# EAGLE schematic MPU-6050_BreakoutV11 (EAGLE 6.1)
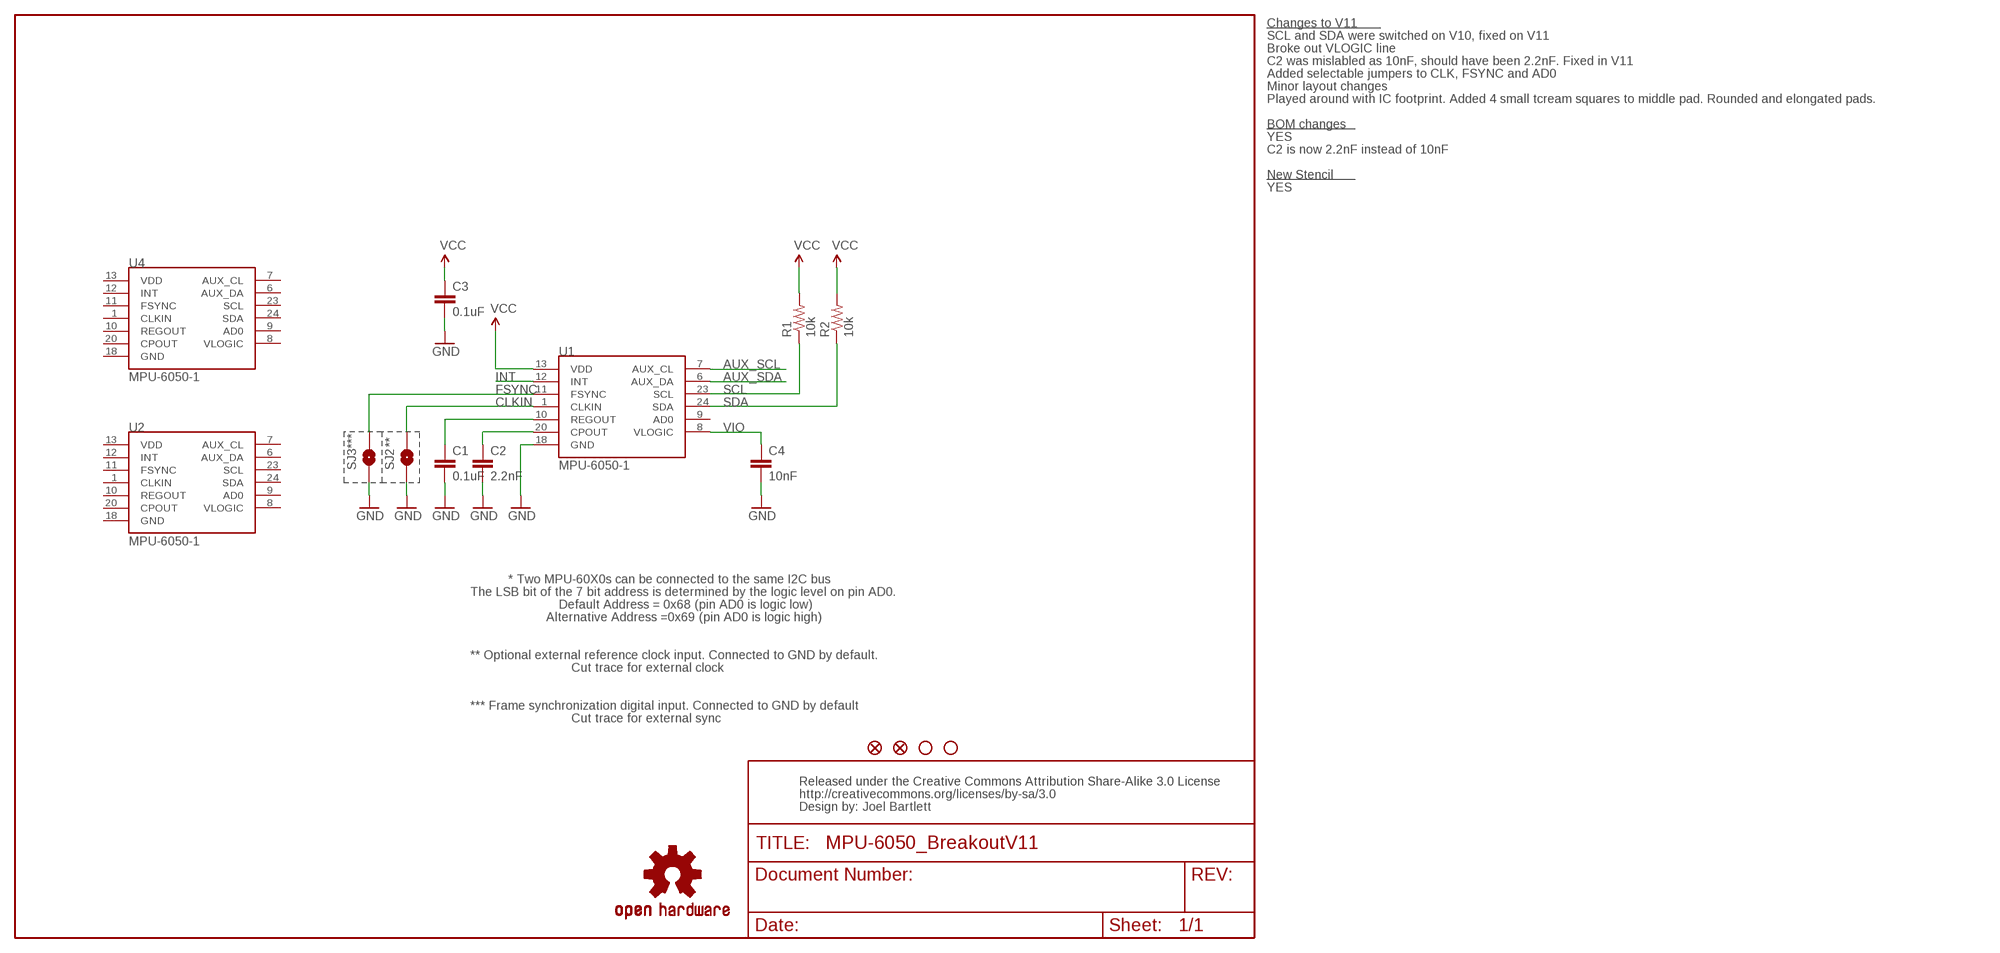
[diagram p0: schematic, sheet 1]

## Parts
C1  0.1uF  CAP0402-CAP  [0402-CAP]
C2  2.2nF  CAP0402-CAP  [0402-CAP]
C3  0.1uF  CAP0402-CAP  [0402-CAP]
C4  10nF  CAP0402-CAP  [0402-CAP]
JP2  FIDUCIALUFIDUCIAL  [MICRO-FIDUCIAL]
JP3  STAND-OFFTIGHT  [STAND-OFF-TIGHT]
JP4  STAND-OFFTIGHT  [STAND-OFF-TIGHT]
JP5  FIDUCIALUFIDUCIAL  [MICRO-FIDUCIAL]
R1  10k  RESISTOR0402-RES  [0402-RES]
R2  10k  RESISTOR0402-RES  [0402-RES]
SJ2  SOLDERJUMPERTRACE  [SJ_2S-TRACE]
SJ3  SOLDERJUMPERTRACE  [SJ_2S-TRACE]
U1  MPU-6050-1  [QFN-24-4MM2]
U2  MPU-6050-1  [QFN-24-4MM2]
U3  CREATIVE_COMMONS  [CREATIVE_COMMONS]
U4  MPU-6050-1  [QFN-24-4MM2]
U$1  OSHW-LOGOS  [OSHW-LOGO-S]

## Nets
AUX_SCL: U1.7(AUX_CL)
AUX_SDA: U1.6(AUX_DA)
CLKIN: SJ2.2 U1.1(CLKIN)
FSYNC: SJ3.2 U1.11(FSYNC)
GND: C1.2 C2.2 C3.2 C4.2 SJ2.1 SJ3.1 U1.18(GND)
INT: U1.12(INT)
N$3: C2.1 U1.20(CPOUT)
N$5: C1.1 U1.10(REGOUT)
SCL: R1.1 U1.23(SCL)
SDA: R2.1 U1.24(SDA)
VCC: C3.1 R1.2 R2.2 U1.13(VDD)
VIO: C4.1 U1.8(VLOGIC)
Unconnected: U1.9(AD0) U2.1(CLKIN) U2.6(AUX_DA) U2.7(AUX_CL) U2.8(VLOGIC) U2.9(AD0) U2.10(REGOUT) U2.11(FSYNC) U2.12(INT) U2.13(VDD) U2.18(GND) U2.20(CPOUT) U2.23(SCL) U2.24(SDA) U4.1(CLKIN) U4.6(AUX_DA) U4.7(AUX_CL) U4.8(VLOGIC) U4.9(AD0) U4.10(REGOUT) U4.11(FSYNC) U4.12(INT) U4.13(VDD) U4.18(GND) U4.20(CPOUT) U4.23(SCL) U4.24(SDA)

## Notes on the sheet
- Changes to V11
- SCL and SDA were switched on V10, fixed on V11
- Broke out VLOGIC line
- C2 was mislabled as 10nF, should have been 2.2nF. Fixed in V11
- Added selectable jumpers to CLK, FSYNC and AD0
- Minor layout changes
- Played around with IC footprint. Added 4 small tcream squares to middle pad. Rounded and elongated pads.
- BOM changes
- YES
- C2 is now 2.2nF instead of 10nF
- New Stencil
- YES
- *** | **
- * Two MPU-60X0s can be connected to the same I2C bus
- The LSB bit of the 7 bit address is determined by the logic level on pin AD0.
- Default Address = 0x68 (pin AD0 is logic low)
- Alternative Address =0x69 (pin AD0 is logic high)
- ** Optional external reference clock input. Connected to GND by default.
- Cut trace for external clock
- *** Frame synchronization digital input. Connected to GND by default
- Cut trace for external sync
- Joel Bartlett

## Library data of the parts
C1-C4 = SparkFun:CAP: Capacitor Standard 0603 ceramic capacitor, and 0.1" leaded capacitor.
JP2 JP5 = SparkFun:FIDUCIAL: Fiducial Alignment Points Various fiducial points for machine vision alignment.
JP3 JP4 = SparkFun:STAND-OFF: Stand Off This is the mechanical footprint for a #4 phillips button head screw. Use the keepout ring to avoid running the screw head into surrounding components. SKU : PRT-00447
R1 R2 = SparkFun:RESISTOR: Resistor Basic schematic elements and footprints for 0603, 1206, and PTH resistors.
SJ2 SJ3 = SparkFun:SOLDERJUMPER: Solder Jumper Standard SMD solder jumper. Used to automate production. Two varients : Normally Open and Normally Closed are the same, but have different paste layers. NC will have a large amount of paste and should jumper during reflow.
U1 U2 U4 = Testing:MPU-6050
U3 = SparkFun:CREATIVE_COMMONS
U$1 = SparkFun:OSHW-LOGO: Open Source Hardware Logo This logo indicates the piece of hardware it is found on incorporates a OSHW license and/or adheres to the definition of open source hardware found here: http://freedomdefined.org/OSHW

## Net classes
0 Default: width 0.203 mm
1 vcc: width 0.254 mm
2 GND: width 0.813 mm